# EAGLE design aux_opto_isolation (EAGLE 7.7.0)
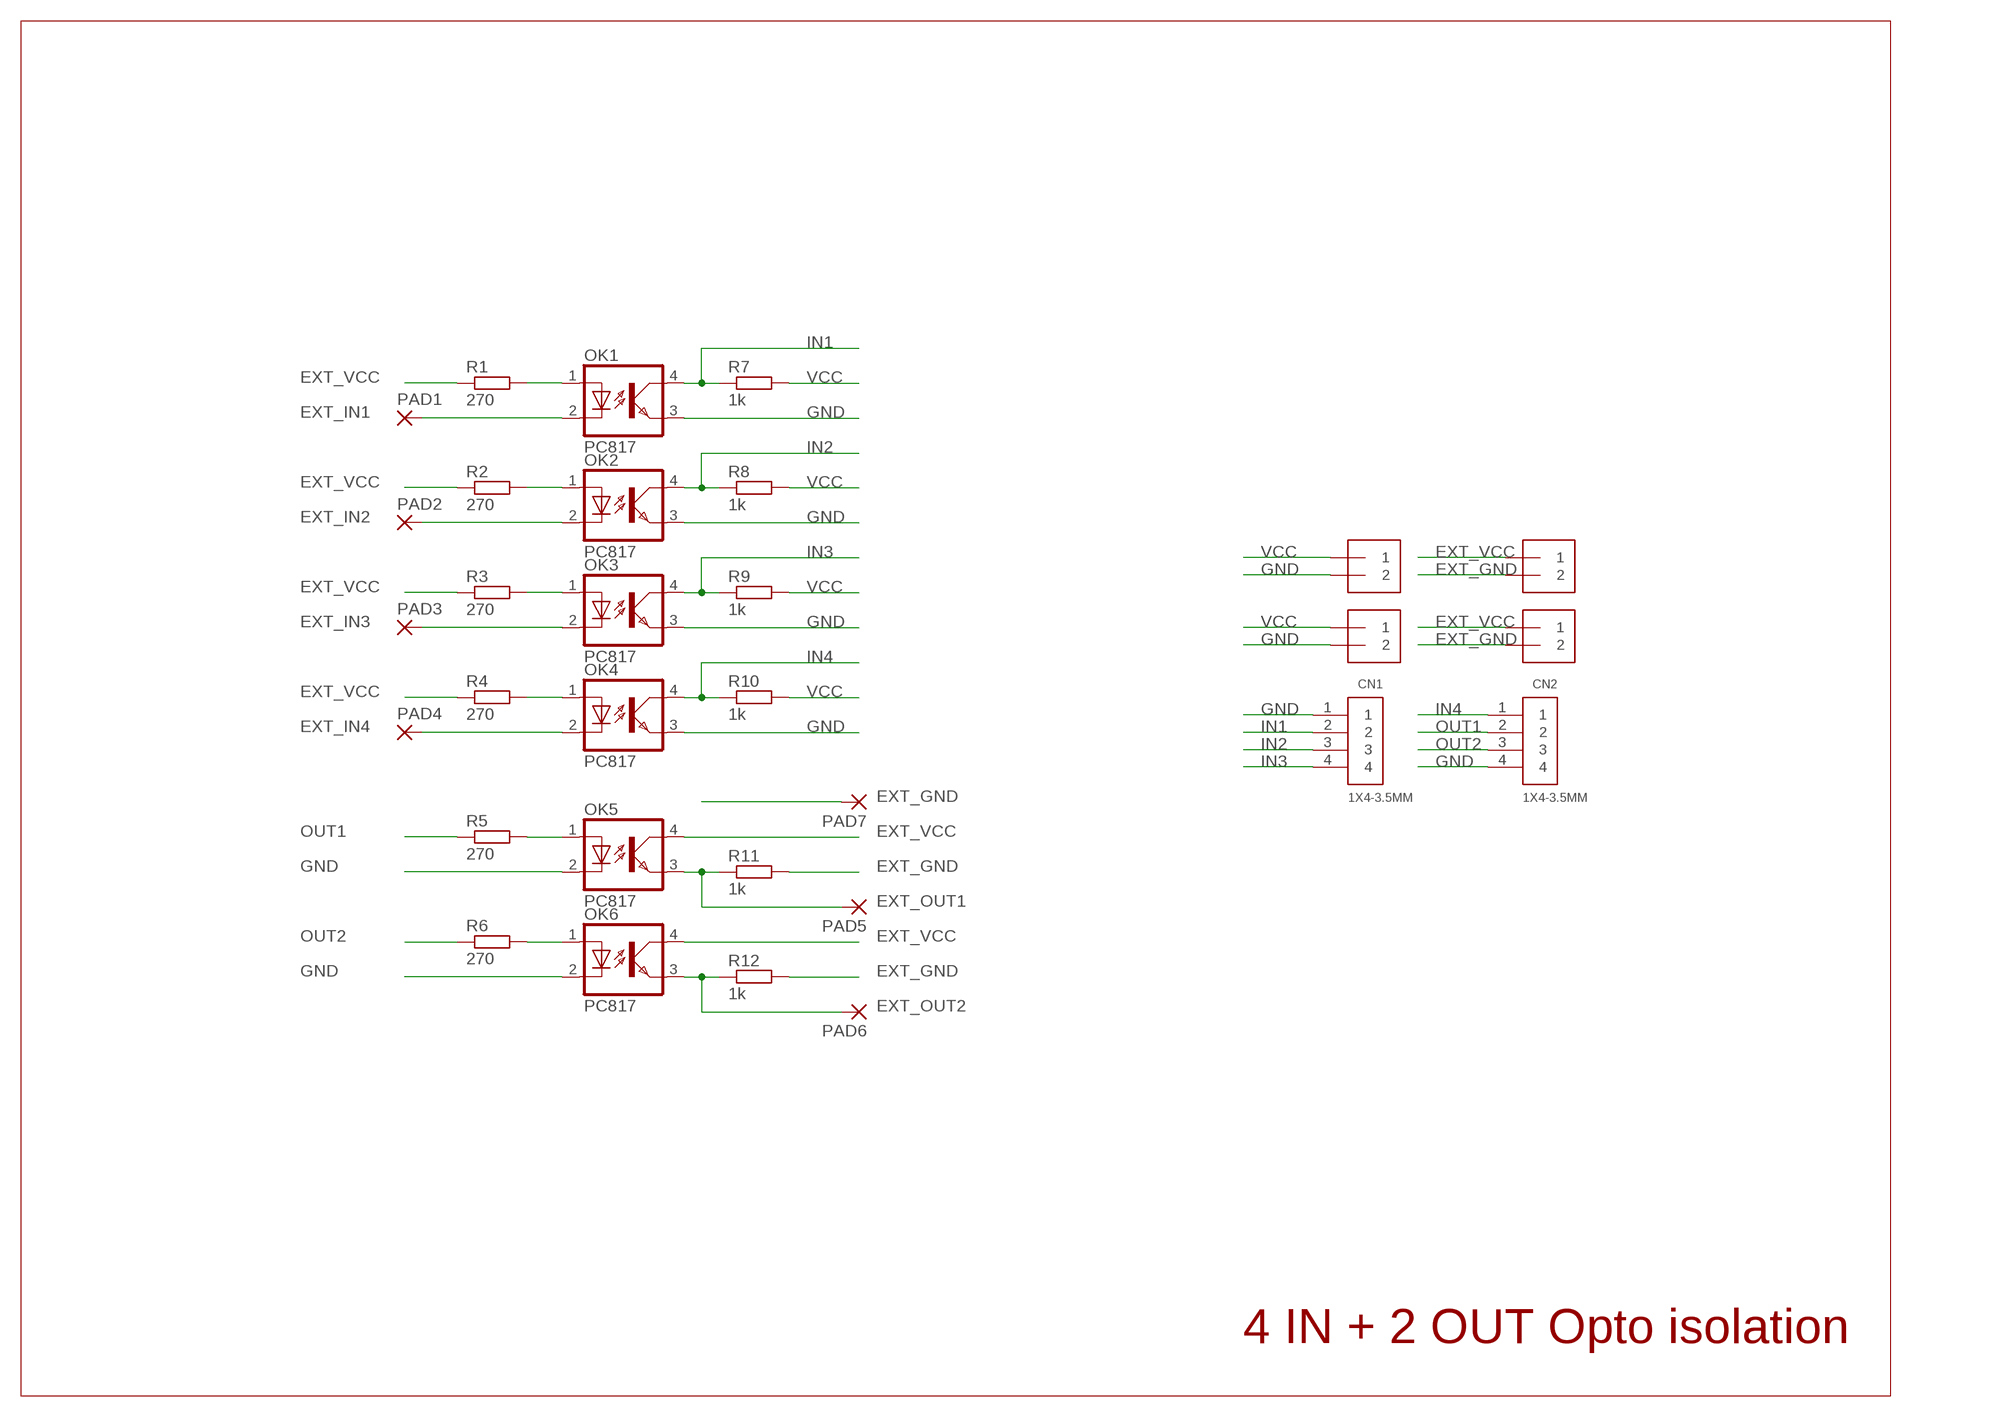
[diagram p0: schematic, sheet 1]

## Parts
CN1  1X4-3.5MM  [1X04-3.5MM]
CN2  1X4-3.5MM  [1X04-3.5MM]
J1  1X2-3.5MM  [1X2-3.5MM]
J2  1X2-3.5MM  [1X2-3.5MM]
J3  1X2-3.5MM  [1X2-3.5MM]
J4  1X2-3.5MM  [1X2-3.5MM]
OK1  PC817  [DIL04]
OK2  PC817  [DIL04]
OK3  PC817  [DIL04]
OK4  PC817  [DIL04]
OK5  PC817  [DIL04]
OK6  PC817  [DIL04]
PAD1  2,54/1,0  [2,54/1,0]
PAD2  2,54/1,0  [2,54/1,0]
PAD3  2,54/1,0  [2,54/1,0]
PAD4  2,54/1,0  [2,54/1,0]
PAD5  2,54/1,0  [2,54/1,0]
PAD6  2,54/1,0  [2,54/1,0]
PAD7  2,54/1,0  [2,54/1,0]
R1  270  R-EU_M0805  [M0805]
R2  270  R-EU_M0805  [M0805]
R3  270  R-EU_M0805  [M0805]
R4  270  R-EU_M0805  [M0805]
R5  270  R-EU_M0805  [M0805]
R6  270  R-EU_M0805  [M0805]
R7  1k  R-EU_M0805  [M0805]
R8  1k  R-EU_M0805  [M0805]
R9  1k  R-EU_M0805  [M0805]
R10  1k  R-EU_M0805  [M0805]
R11  1k  R-EU_M0805  [M0805]
R12  1k  R-EU_M0805  [M0805]

## Nets
EXT_GND: J2.2 J4.2 PAD7.1(P) R11.2 R12.2
EXT_IN1: OK1.2(C) PAD1.1(P)
EXT_IN2: OK2.2(C) PAD2.1(P)
EXT_IN3: OK3.2(C) PAD3.1(P)
EXT_IN4: OK4.2(C) PAD4.1(P)
EXT_OUT1: OK5.3(EMIT) PAD5.1(P) R11.1
EXT_OUT2: OK6.3(EMIT) PAD6.1(P) R12.1
EXT_VCC: J2.1 J4.1 OK5.4(COL) OK6.4(COL) R1.1 R2.1 R3.1 R4.1
GND: CN1.1 CN2.4 J1.2 J3.2 OK1.3(EMIT) OK2.3(EMIT) OK3.3(EMIT) OK4.3(EMIT) OK5.2(C) OK6.2(C)
IN1: CN1.2 OK1.4(COL) R7.1
IN2: CN1.3 OK2.4(COL) R8.1
IN3: CN1.4 OK3.4(COL) R9.1
IN4: CN2.1 OK4.4(COL) R10.1
N$2: OK5.1(A) R5.2
N$5: OK6.1(A) R6.2
N$7: OK2.1(A) R2.2
N$8: OK3.1(A) R3.2
N$10: OK4.1(A) R4.2
N$12: OK1.1(A) R1.2
OUT1: CN2.2 R5.1
OUT2: CN2.3 R6.1
VCC: J1.1 J3.1 R7.2 R8.2 R9.2 R10.2

## Notes on the sheet
- 4 IN + 2 OUT Opto isolation

## Library data of the parts
CN1 CN2 = adafruit:1X4: 4-pin connector
J1-J4 = adafruit:1X2: 3.5mm Terminal block http://www.ladyada.net/library/pcb/eaglelibrary.html
OK1-OK6 = optocoupler:PC817: SHARP OPTO COUPLER; MPN: PC817X4J000F; OC_FARNELL: 9707727; OC_NEWARK: 97K7059
PAD1-PAD7 = wirepad:2,54/1,0: THROUGH-HOLE PAD
R1-R12 = rcl:R-EU_: RESISTOR, European symbol

## Board
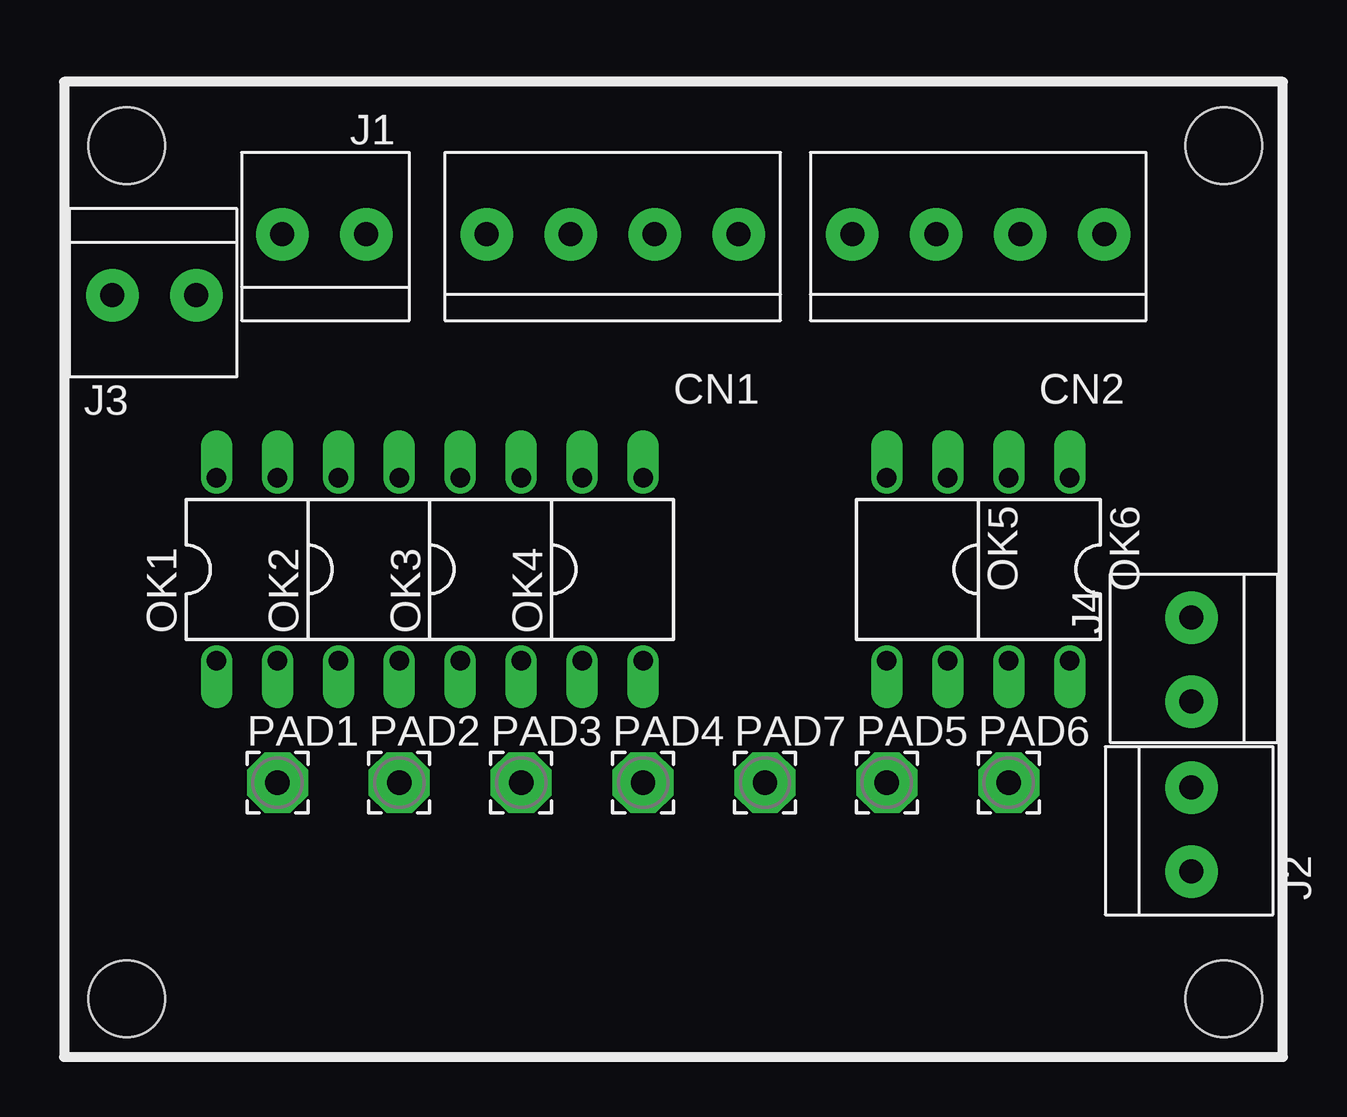
[diagram p1: board, top side]
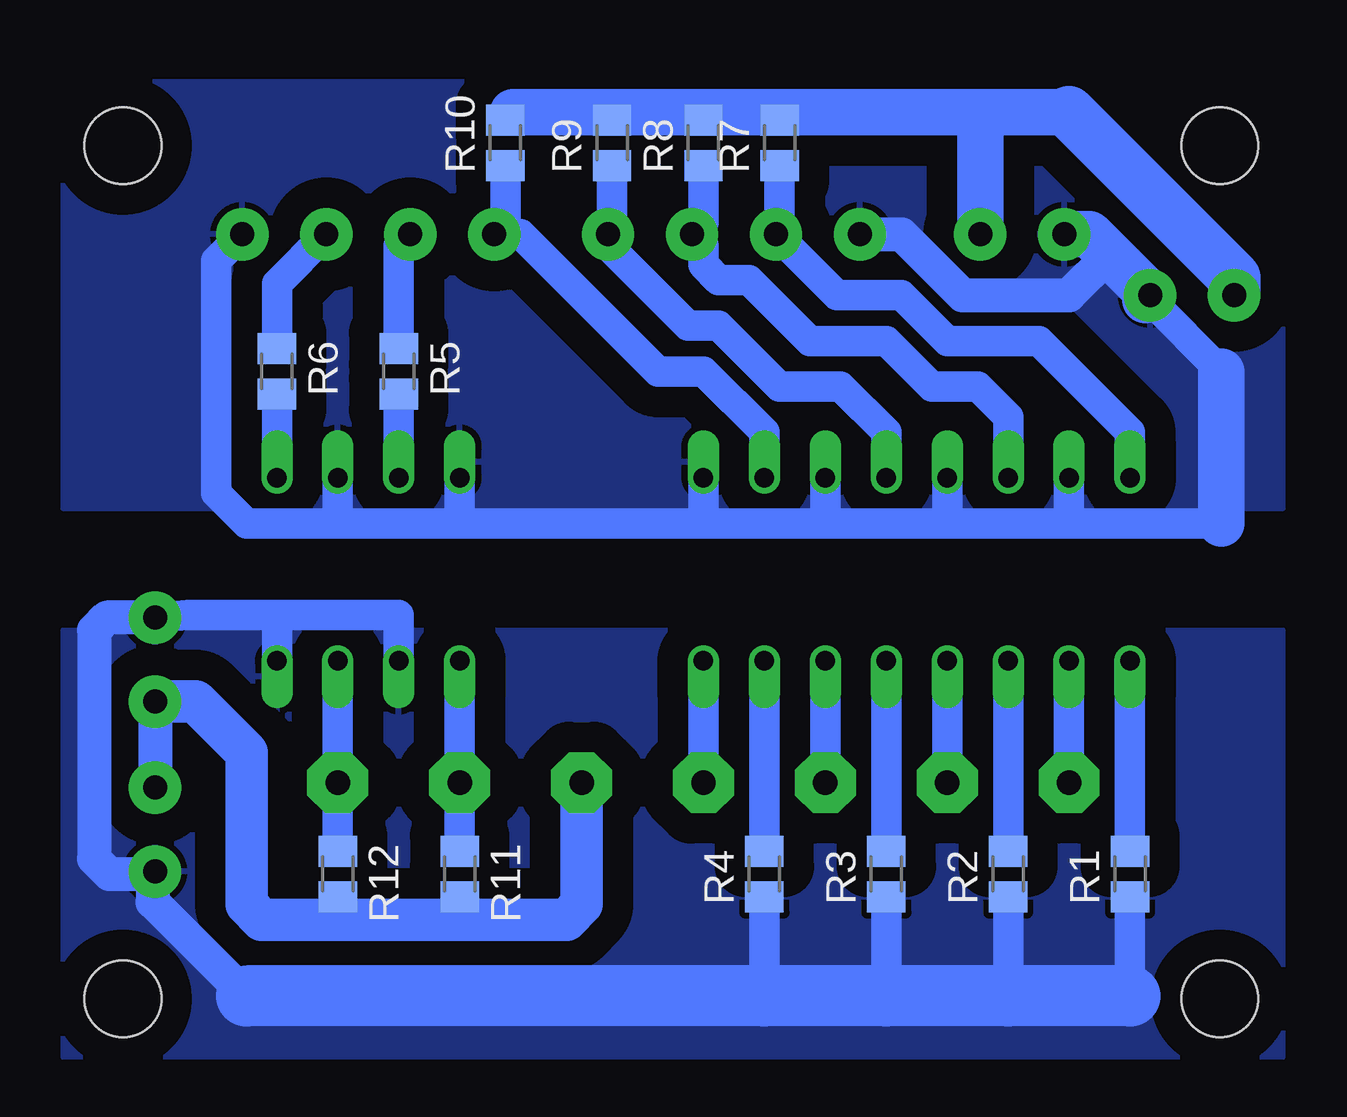
[diagram p2: board, bottom side, seen from below]

No outline drawn. Coordinates in mm, seen from the top.
Copper layers (1*16): Top 0.035mm / dielectric 1.5mm / Bottom 0.035mm
Design rules "default": minimum track width 10mil, minimum drill 24mil, track to track 8mil, track to pad 8mil, pad to pad 8mil, via to via 8mil, smd to smd 8mil, copper to edge 40mil, drill to drill 8mil, minimum pad ring 10mil, minimum via ring 8mil, stop-mask expansion 4mil, vias tented up to drill 0mil, thermal gap 10mil
Holes 3.2 mm at 2.61,2.42 48.33,2.42 2.61,37.98 48.33,37.98

### Footprints (pad centres in the part's own frame; a part is rotated, then mirrored left to right if it is on the bottom)
1X04-3.5MM = drill 1 pad 2.184: 1 -5.25,0; 2 -1.75,0; 3 1.75,0; 4 5.25,0
1X2-3.5MM = drill 1 pad 2.184: 1 1.8,0; 2 -1.7,0
DIL04 = drill 0.813 offset: 1 -1.27,-3.81; 2 1.27,-3.81; 3 1.27,3.81; 4 -1.27,3.81
2,54/1,0 = drill 1.016 pad 2.54 octagon: 1 0,0
M0805 = smd 1.3 x 1.6: 1 -0.95,0; 2 0.95,0

### Placement (x,y rotation side)
CN1  22.86,34.29 0 top
CN2  38.1,34.29 0 top
J1  10.79,34.29 0 top
J2  46.99,9.53 270 top
J3  3.81,31.75 180 top
J4  46.99,16.51 90 top
OK1  7.62,20.32 0 top
OK2  12.7,20.32 0 top
OK3  17.78,20.32 0 top
OK4  22.86,20.32 0 top
OK5  35.56,20.32 180 top
OK6  40.64,20.32 180 top
PAD1  8.89,11.43 0 top
PAD2  13.97,11.43 0 top
PAD3  19.05,11.43 0 top
PAD4  24.13,11.43 0 top
PAD5  34.29,11.43 0 top
PAD6  39.37,11.43 0 top
PAD7  29.21,11.43 0 top
R1  6.35,7.62 90 bottom
R2  11.43,7.62 90 bottom
R3  16.51,7.62 90 bottom
R4  21.59,7.62 90 bottom
R5  36.83,28.57 270 bottom
R6  41.91,28.57 270 bottom
R7  20.95,38.1 90 bottom
R8  24.13,38.1 90 bottom
R9  27.94,38.1 90 bottom
R10  32.38,38.1 90 bottom
R11  34.29,7.62 270 bottom
R12  39.37,7.62 270 bottom

### Tracks (layer width: path | path; a pad name or v marks a point on that pad's centre or on a via)
EXT_GND
  Bottom 1.27: R11.2 34.29,5.71 | R12.2 39.37,5.71
  Bottom 1.422: J4.2 J2.2
  Bottom 1.778: J4.2 45.29,14.81 43.18,12.7 43.18,6.35 42.55,5.71 39.37,5.71 34.92,5.71 34.29,5.71 29.84,5.71 29.21,6.35 PAD7.1
EXT_IN1
  Bottom 1.27: OK1.2 PAD1.1
EXT_IN2
  Bottom 1.27: OK2.2 PAD2.1
EXT_IN3
  Bottom 1.27: OK3.2 PAD3.1
EXT_IN4
  Bottom 1.27: OK4.2 PAD4.1
EXT_OUT1
  Bottom 1.27: OK5.3 PAD5.1 34.29,10.16 R11.1
EXT_OUT2
  Bottom 1.27: R12.1 39.37,10.16 PAD6.1 OK6.3
EXT_VCC
  Bottom 1.27: OK5.4 36.83,18.41 41.91,18.41 | 41.91,18.41 45.62,18.41 J4.1 | OK6.4 41.91,18.41 | R1.1 6.35,2.54 | R2.1 11.43,2.54 | R3.1 16.51,2.54 | R4.1 21.59,2.54
  Bottom 1.422: J4.1 49,18.31 49.53,17.78 49.53,8.26 48.9,7.62 47.09,7.62 | 47.09,7.62 J2.1 | 47.09,7.62 47.09,6.46 43.18,2.54
  Bottom 2.54: 6.35,2.54 11.43,2.54 16.51,2.54 21.59,2.54 43.18,2.54
  pour Bottom (isolate 1.27): 0,0 50.8,0 50.8,17.78 0,17.78
GND
  Bottom 1.27: OK1.3 8.89,22.23 | 8.89,22.23 2.54,22.23 | OK4.3 24.13,22.23 | 24.13,22.23 19.05,22.23 | 19.05,22.23 13.97,22.23 | 13.97,22.23 8.89,22.23 | OK2.3 13.97,22.23 | OK3.3 19.05,22.23 | J3.2 5.51,31.55 2.54,28.57 | OK6.2 39.37,22.23 | 39.37,22.23 34.29,22.23 | 34.29,22.23 24.13,22.23 | OK5.2 34.29,22.23 | 39.37,22.23 43.18,22.23 44.45,23.5 44.45,33.19 CN2.4
  Bottom 1.422: CN1.1 15.88,34.29 13.34,31.75 8.89,31.75 7.2,33.44
  Bottom 1.93: 2.54,22.23 2.54,28.57 | 5.71,31.55 J3.2 7.2,33.44 8.05,34.29 J1.2
  pour Bottom (isolate 1.27): 0,22.86 50.8,22.86 50.8,40.64 0,40.64
IN1
  Bottom 1.27: R7.1 20.95,34.45 CN1.2 18.57,31.75 15.88,31.75 13.97,29.84 10.16,29.84 6.35,26.04 OK1.4
IN2
  Bottom 1.27: R8.1 24.13,34.77 CN1.3 24.13,33.81 24.13,33.02 23.5,32.38 22.23,32.38 19.68,29.84 16.51,29.84 14.61,27.94 12.7,27.94 11.43,26.67 OK2.4
IN3
  Bottom 1.27: R9.1 27.94,34.46 CN1.4 27.94,34.12 27.94,33.66 24.77,30.48 23.5,30.48 20.95,27.94 18.41,27.94 16.51,26.04 OK3.4
IN4
  Bottom 1.27: R10.1 32.38,34.76 CN2.1 31.75,34.29 26.04,28.57 24.13,28.57 21.59,26.04 OK4.4
N$2
  Bottom 1.27: OK5.1 R5.2
N$5
  Bottom 1.27: OK6.1 R6.2
N$7
  Bottom 1.27: OK2.1 R2.2
N$8
  Bottom 1.27: OK3.1 R3.2
N$10
  Bottom 1.27: OK4.1 R4.2
N$12
  Bottom 1.27: R1.2 OK1.1
OUT1
  Bottom 1.27: R5.1 36.83,33.81 CN2.2
OUT2
  Bottom 1.27: R6.1 41.91,32.23 CN2.3
VCC
  Bottom 1.27: 32.06,39.37 R10.2 | R7.2 19.68,39.37 | R8.2 22.55,39.05 22.23,39.37 | R9.2 27.62,39.05 27.94,39.37
  Bottom 1.93: 8.89,39.37 12.7,39.37 | 12.7,39.37 19.68,39.37 22.23,39.37 27.94,39.37 32.06,39.37 | J1.1 12.6,39.27 12.7,39.37
  Bottom 2.184: J3.1 2.01,32.49 8.89,39.37